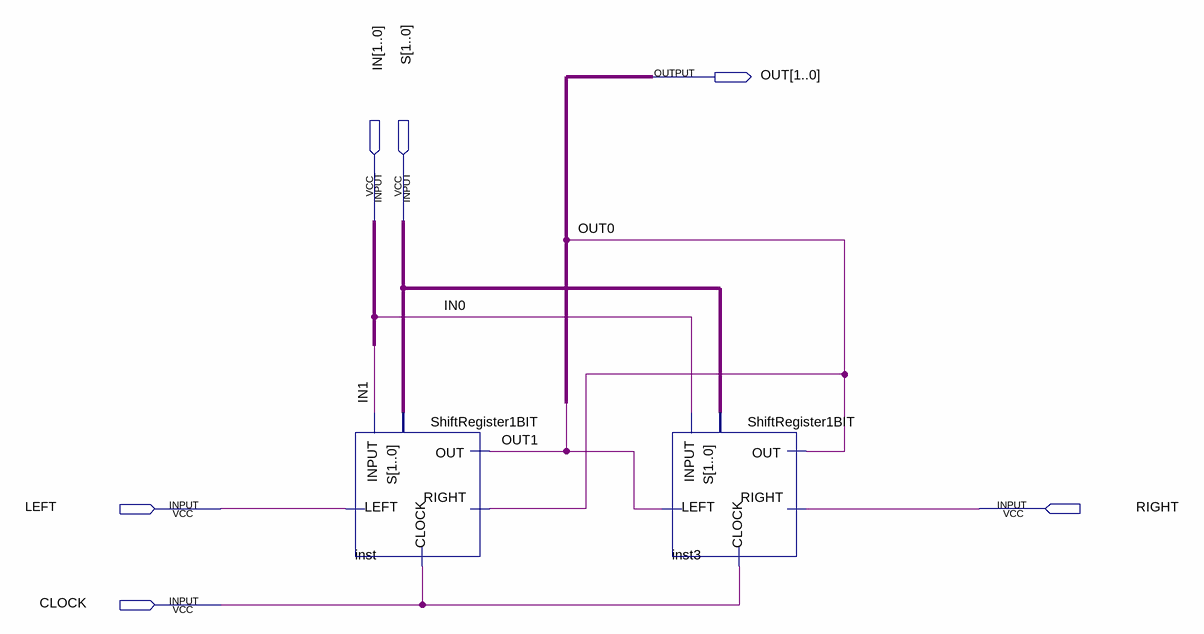
[diagram p0: schematic sheet]
// Quartus schematic ShiftRegister2BIT.bdf as structural Verilog: 2 symbols, 6 pins
module ShiftRegister2BIT (
  input  [1:0] IN,
  input  [1:0] S,
  input  LEFT,
  input  RIGHT,
  input  CLOCK,
  output [1:0] OUT
);

  ShiftRegister1BIT inst (.INPUT(IN[1]), .S(S), .RIGHT(OUT[0]), .LEFT(LEFT), .CLOCK(CLOCK), .OUT(OUT[1]));
  ShiftRegister1BIT inst3 (.INPUT(IN[0]), .S(S), .RIGHT(RIGHT), .LEFT(OUT[1]), .CLOCK(CLOCK), .OUT(OUT[0]));
endmodule
